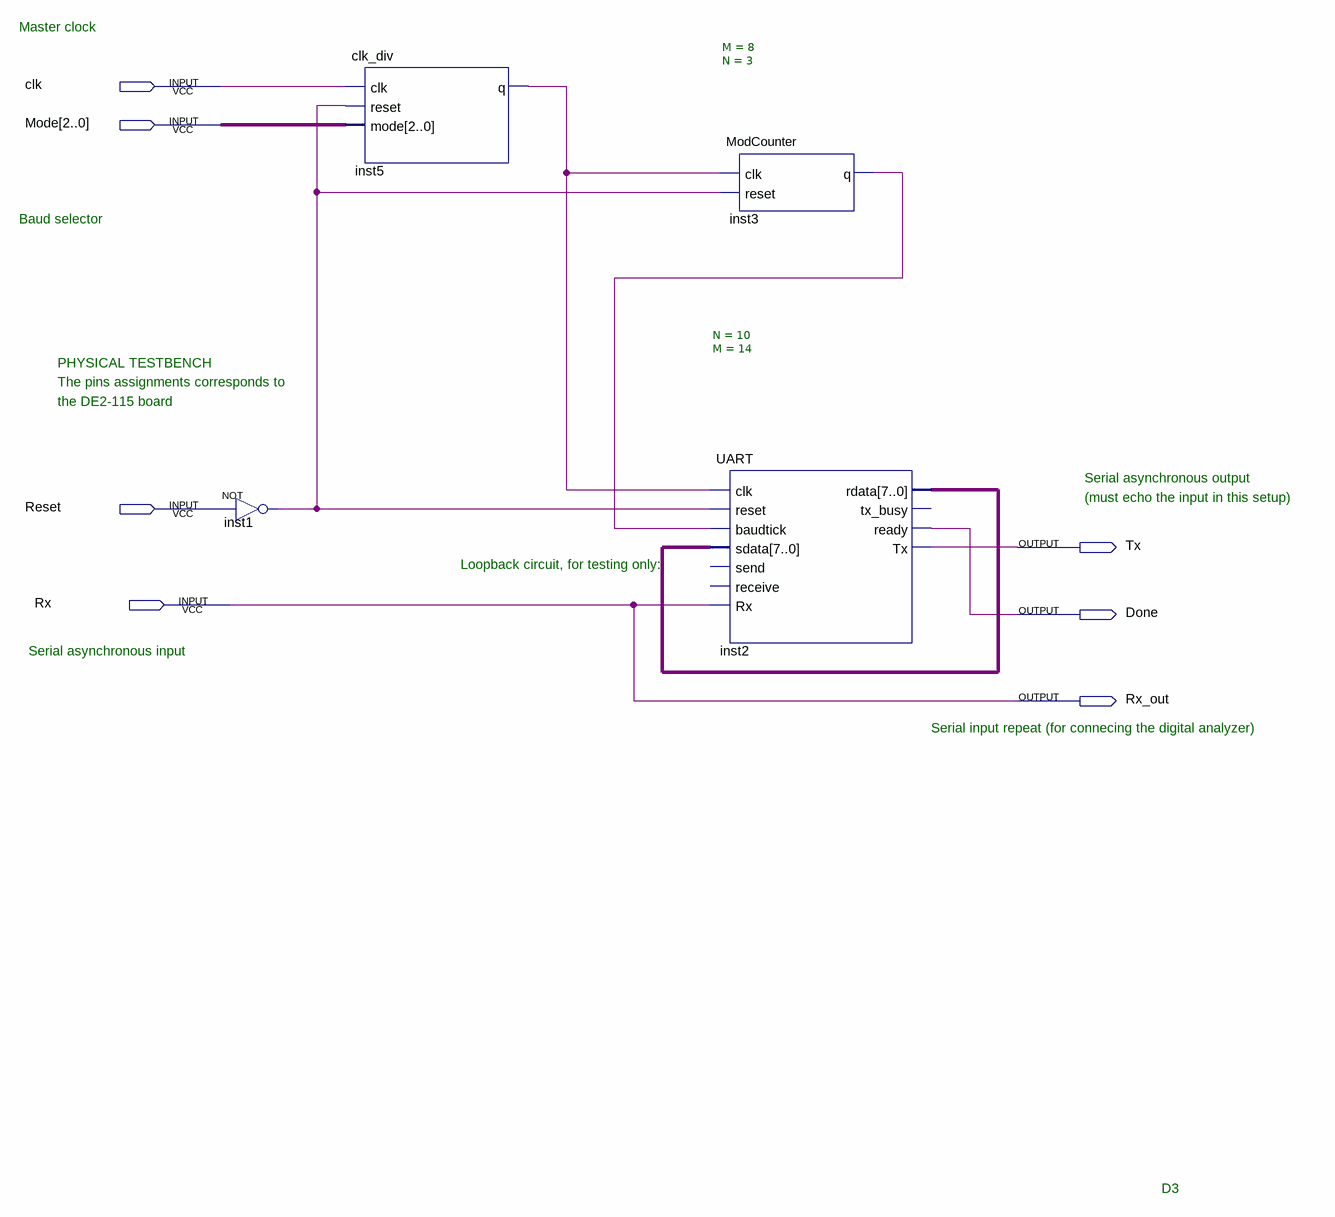
[diagram p0: schematic sheet]
// Quartus schematic Main.bdf as structural Verilog: 4 symbols, 7 pins
module Main (
  input  clk,
  input  [2:0] Mode,
  input  Reset,
  input  Rx,
  output Tx,
  output Done,
  output Rx_out
);

  wire inst1_out, inst3_q, inst5_q;
  wire [7:0] inst2_rdata;

  not inst1 (inst1_out, Reset);
  clk_div inst5 (.clk(clk), .reset(inst1_out), .mode(Mode), .q(inst5_q));
  ModCounter #(.M(8), .N(3)) inst3 (.clk(inst5_q), .reset(inst1_out), .q(inst3_q));
  UART #(.N(10), .M(14)) inst2 (
    .clk(inst5_q), .reset(inst1_out), .baudtick(inst3_q), .sdata(inst2_rdata), .Rx(Rx), .rdata(inst2_rdata),
    .ready(Done), .Tx(Tx));  // open: send, receive, tx_busy

  assign Rx_out = Rx;

  // Notes on the sheet:
  //   Master clock
  //   Baud selector
  //   PHYSICAL TESTBENCH
  //   The pins assignments corresponds to
  //   the DE2-115 board
  //   Serial asynchronous output
  //   (must echo the input in this setup)
  //   Loopback circuit, for testing only:
  //   Serial asynchronous input
  //   Serial input repeat (for connecing the digital analyzer)
  //   D3
endmodule
